# Altium schematic sheet STM3205P_VoltageControl.SchDoc
size A3; Organization: Canis Tech; Address1: -; Address2: -; Address3: -; Address4: Indaiatuba/SP; DocumentNumber: 8; SheetNumber: 8; SheetTotal: 9; Address5: Brazil
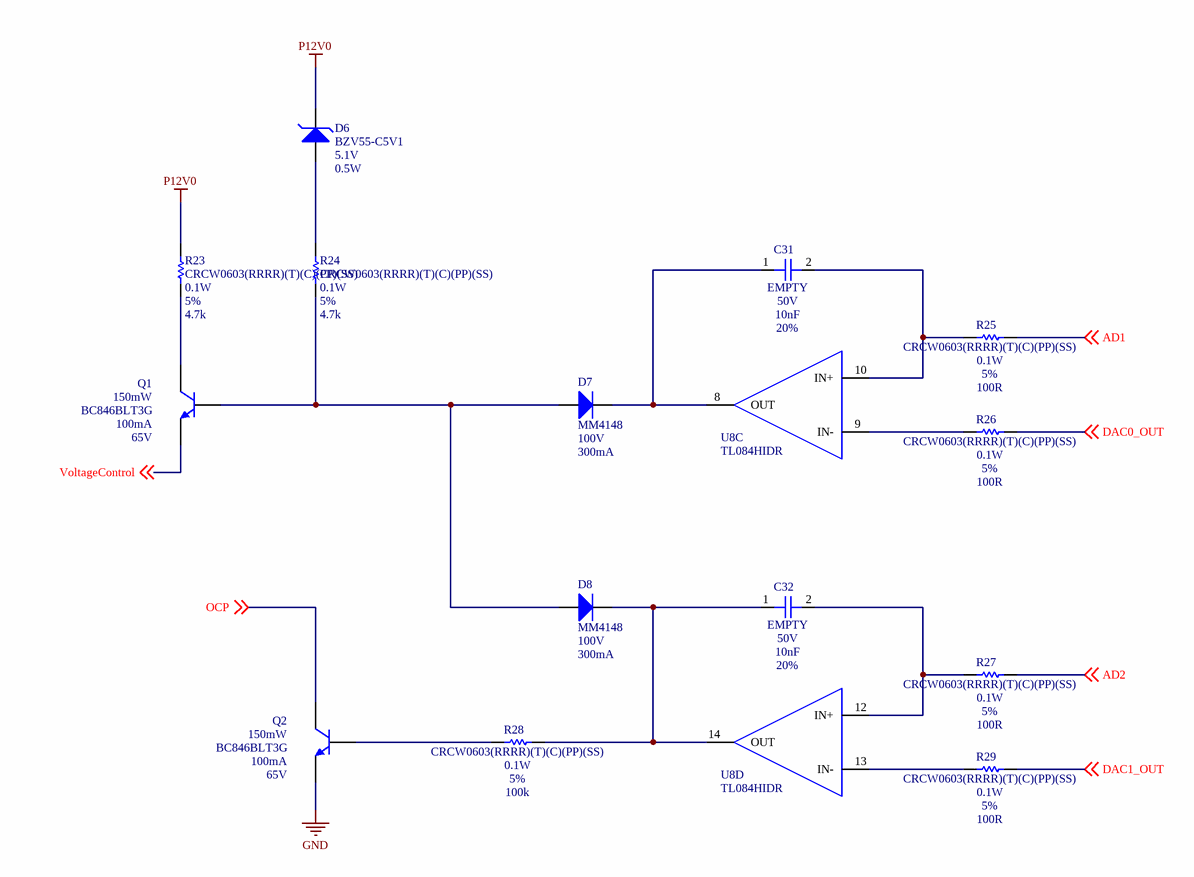
[diagram p0: STM3205P_VoltageControl.SchDoc]

## Parts
C31  value 10nF  PartNumber1: EMPTY  Voltage: 50V  Tolerance: 20%  [CAP0603]  (hidden comment: CC0603)
C32  value 10nF  PartNumber1: EMPTY  Voltage: 50V  Tolerance: 20%  [CAP0603]  (hidden comment: CC0603)
D6  value 5.1V  Power: 0.5W  [SOD-80C]  (hidden comment: BZV55-C5V1)
D7  Vrrm: 100V  If: 300mA  [SOD-80C]  (hidden comment: MM4148)
D8  Vrrm: 100V  If: 300mA  [SOD-80C]  (hidden comment: MM4148)
Q1  Power: 150mW  PartNumber1: BC846BLT3G  Ic: 100mA  Vce: 65V  [SOT-23]  (hidden comment: BC846B)
Q2  Power: 150mW  PartNumber1: BC846BLT3G  Ic: 100mA  Vce: 65V  [SOT-23]  (hidden comment: BC846B)
R23  value 4.7k  PartNumber1: CRCW0603(RRRR)(T)(C)(PP)(SS)  Power: 0.1W  Tolerance: 5%  [RES0603]  (hidden comment: Chip Resistor)
R24  value 4.7k  PartNumber1: CRCW0603(RRRR)(T)(C)(PP)(SS)  Power: 0.1W  Tolerance: 5%  [RES0603]  (hidden comment: Chip Resistor)
R25  value 100R  PartNumber1: CRCW0603(RRRR)(T)(C)(PP)(SS)  Power: 0.1W  Tolerance: 5%  [RES0603]  (hidden comment: Chip Resistor)
R26  value 100R  PartNumber1: CRCW0603(RRRR)(T)(C)(PP)(SS)  Power: 0.1W  Tolerance: 5%  [RES0603]  (hidden comment: Chip Resistor)
R27  value 100R  PartNumber1: CRCW0603(RRRR)(T)(C)(PP)(SS)  Power: 0.1W  Tolerance: 5%  [RES0603]  (hidden comment: Chip Resistor)
R28  value 100k  PartNumber1: CRCW0603(RRRR)(T)(C)(PP)(SS)  Power: 0.1W  Tolerance: 5%  [RES0603]  (hidden comment: Chip Resistor)
R29  value 100R  PartNumber1: CRCW0603(RRRR)(T)(C)(PP)(SS)  Power: 0.1W  Tolerance: 5%  [RES0603]  (hidden comment: Chip Resistor)
U8  TL084HIDR  [SOIC-14-3.9mm]  (parts C,D of 4)

## Nets
GND: Q2.2(E)
P12V0: D6.K R23.2
AD1: R25.2 ; off-sheet AD1
AD2: R27.2 ; off-sheet AD2
DAC0_OUT: R26.2 ; off-sheet DAC0_OUT
DAC1_OUT: R29.2 ; off-sheet DAC1_OUT
OCP: Q2.3(C) ; off-sheet OCP
VoltageControl: Q1.2(E) ; off-sheet VoltageControl
NetC31_1: C31.1 D7.K U8.8(OUT)
NetC31_2: C31.2 R25.1 U8.10(IN+)
NetC32_1: C32.1 D8.K R28.2 U8.14(OUT)
NetC32_2: C32.2 R27.1 U8.12(IN+)
NetD6_A: D6.A R24.2
NetD7_A: D7.A D8.A Q1.1(B) R24.1
NetQ1_3: Q1.3(C) R23.1
NetQ2_1: Q2.1(B) R28.1
NetR26_1: R26.1 U8.9(IN-)
NetR29_1: R29.1 U8.13(IN-)

## Notes on the sheet
- Title
- Author
- Checked By
- Variant
- Size:
- Revision:
- A3
- Date:
- Project
- Time:
- Sheet
- of
- File:

## Library data of the parts
C31 C32 = CC0603: Surface Mount Multilayer Ceramic Chip Capacitors  for Commercial Applications; Manufacturer1: Yageo; Published: 19-Jun-2016; LatestRevisionDate: 19-Jun-2016; Publisher: Lucas Moraes; PackageReference: CAP0603; PackageDescription: CAP0603;2 Leads
D6 = BZV55-C5V1: Zener Diodes 5.1V 0.5W; Manufacturer1: Nexperia; Published: 02-May-2024; LatestRevisionDate: 02-May-2024; PackageReference: SOD-80C; Publisher: Lucas Moraes; PackageDescription: SOD-80C; 2 Leads; PartNumber1: BZV55-C5V1
D7 D8 = MM4148: General Purpose Plastic Rectifier; Vf: 1.0V; Published: 11-May-2016; LatestRevisionDate: 11-May-2016; PackageReference: SOD-80C; Publisher: Lucas Moraes; PackageDescription: SOD-80C; 2 Leads; PartNumber1: MM4148
Q1 Q2 = BC846B: Transistor BJT NPN 65V 0.1A 150mW; Manufacturer1: onsemi; hFe: 300; Published: 20-Sep-2018; LatestRevisionDate: 20-Sep-2018; PackageReference: SOT23; Publisher: Lucas Moraes; PackageDescription: SOT23; 3Leads; LatestRevisionNote: Created
R23-R29 = CRCW0603: Thick Film Chip Resistors with CECC Approval,  available with Established Reliability; Manufacturer1: Vishay; LatestRevisionDate: 06-May-2016; PackageReference: 0603; Publisher: Lucas Moraes; PackageDescription: SMD 0603; 2 Leads; Published: 06-May-2016
U8 = TL084HIDR: Quad Operational Amplifiers RRIO; Manufacturer1: Texas Instruments; Published: 27-Aug-2025; LatestRevisionDate: 27-Aug-2025; LatestRevisionNote: Created; PackageReference: SOIC14; Publisher: Lucas Moraes; PackageDescription: SOIC14; 14 Leads; Datasheet: https://www.ti.com/lit/ds/symlink/tl084.pdf; PartNumber1: TL084HIDR